# Altium project PCB_Project2.PrjPCB
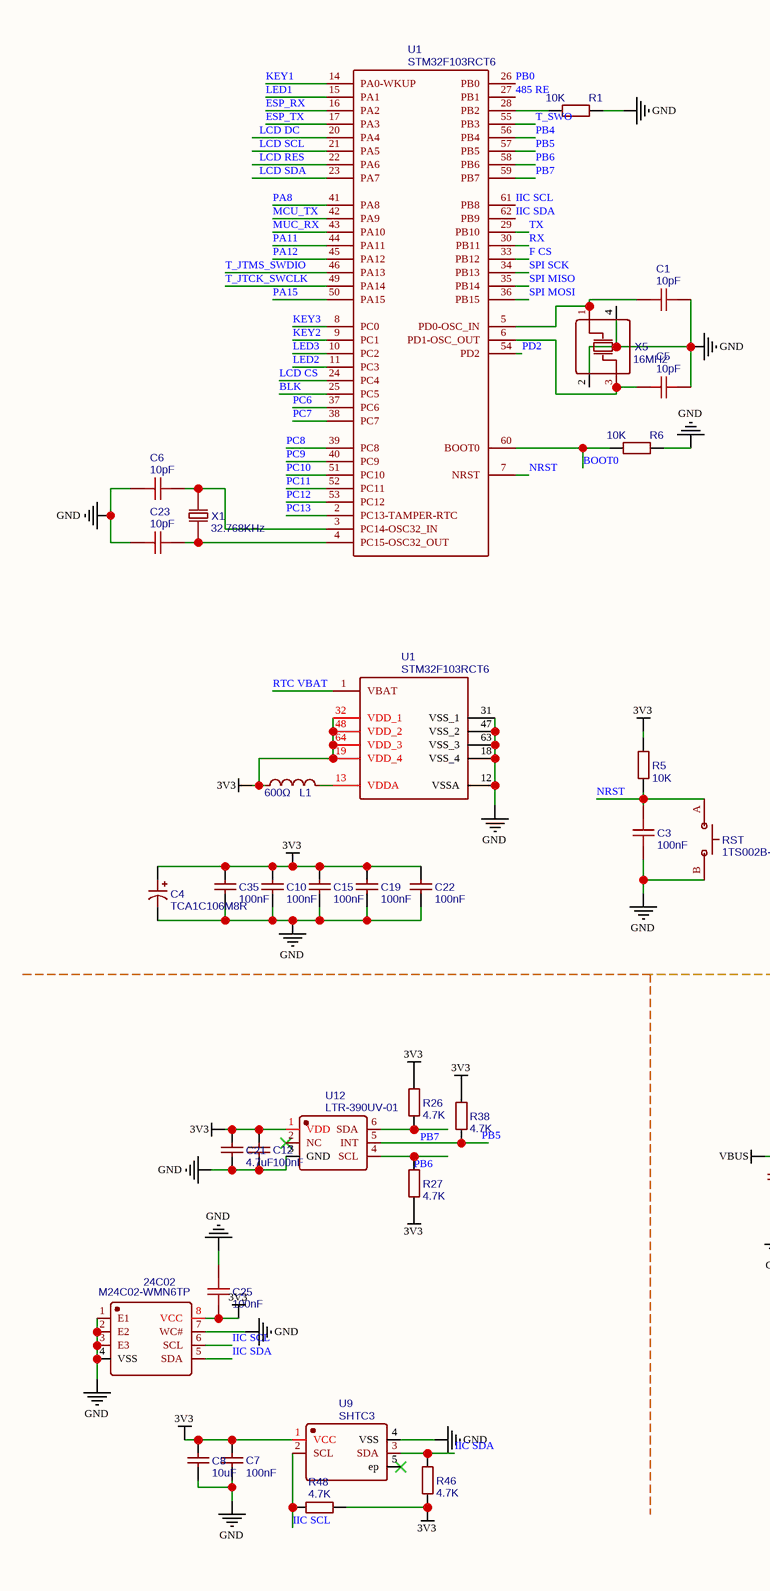
[diagram p0: Sheet_1_2022-02-19.schdoc, left]
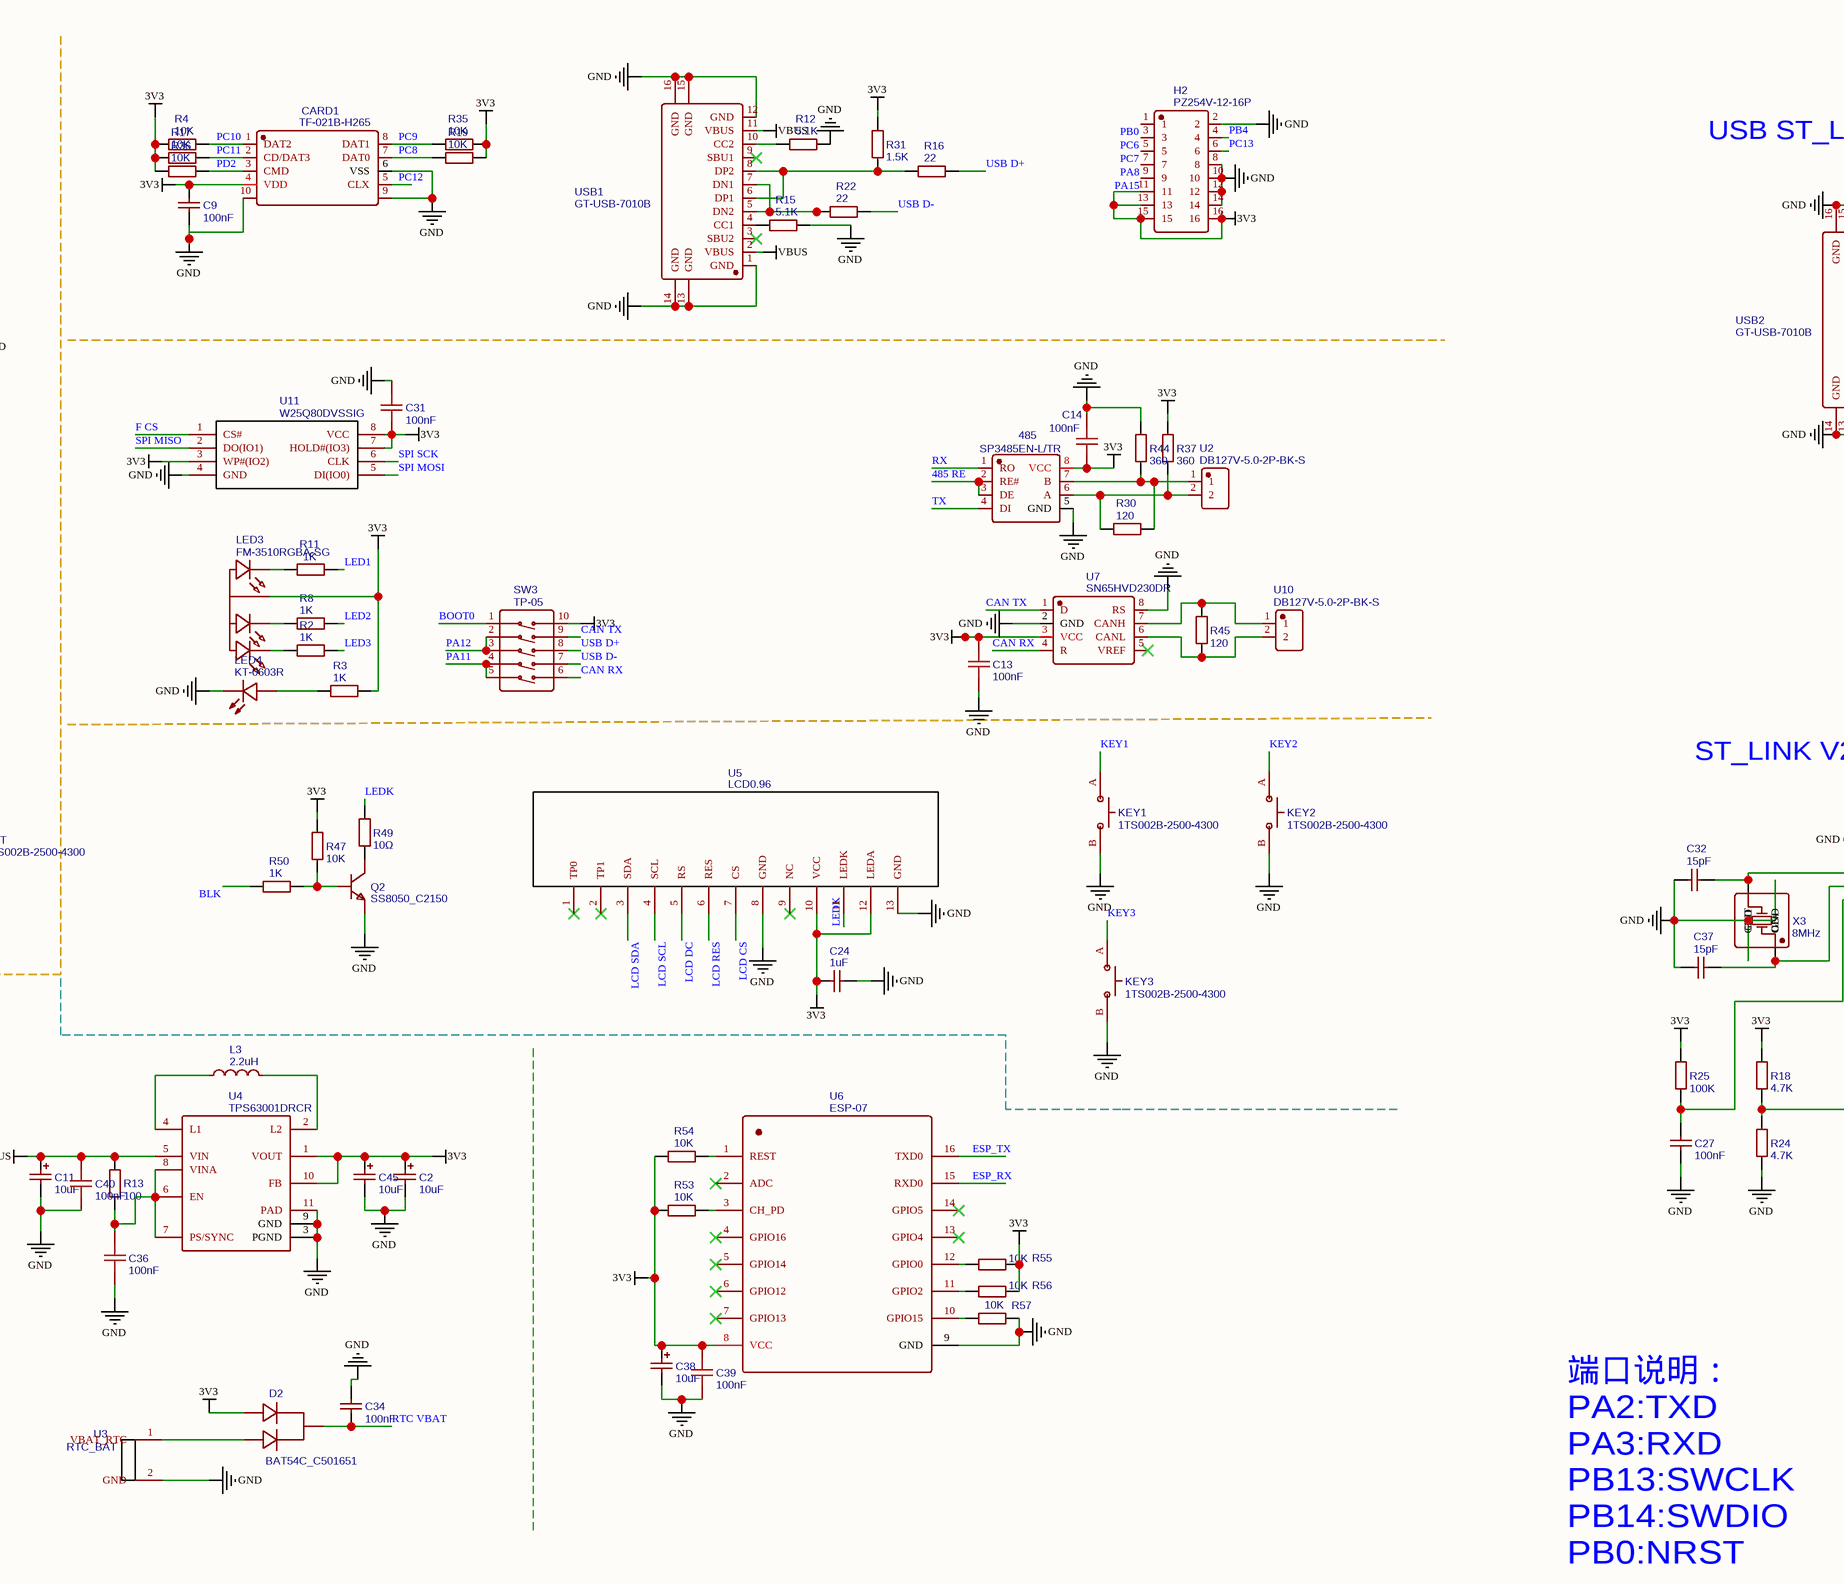
[diagram p1: Sheet_1_2022-02-19.schdoc, middle]
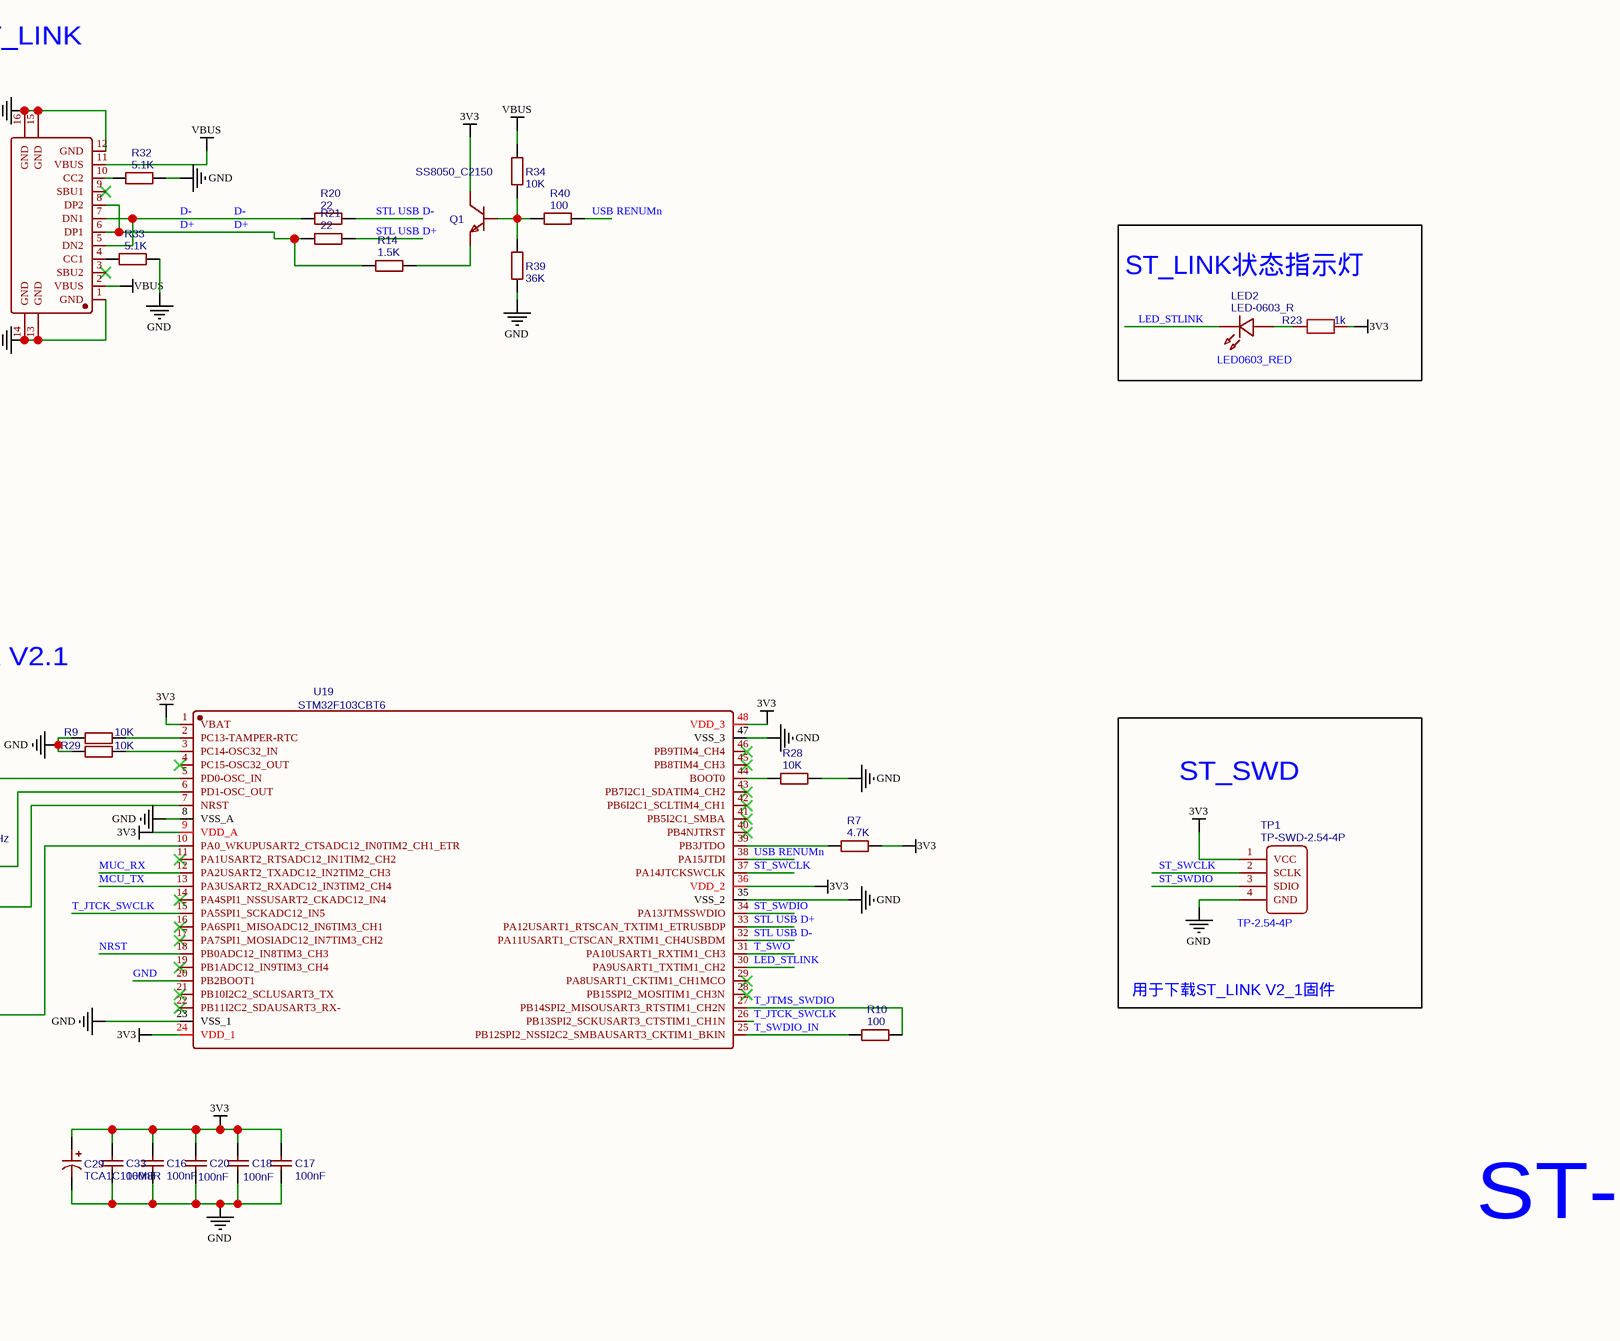
[diagram p2: Sheet_1_2022-02-19.schdoc, right]
1 sheet, 126 parts. Net scope: global (net labels, ports and power ports of the same name join across sheets).
Board file: F103RCT6验证板_2022-02-19.pcbdoc

## Sheet Sheet_1_2022-02-19.schdoc
size 832 x 302 mm

### Parts
(Parts that share a designator on the sheet are numbered #1, #2 ... from top to bottom, then left to right.)
24C02  M24C02-WMN6TP  [SOIC-8_L4.9-W3.9-P1.27-LS6.0-BL]
485  SP3485EN-L/TR  [SOIC-8_L5.0-W4.0-P1.27-LS6.0-BL]
C1  10pF  [C0402]
C2  10uF  [CAP-SMD_L3.2-W1.6-R-RD]
C3  100nF  [C0603]
C4  TCA1C106M8R  [CAP-SMD_L3.2-W1.6-FD]
C5  10pF  [C0402]
C6  10pF  [C0402]
C7  100nF  [C0402_NEW]
C8  10uF  [C0402]
C9  100nF  [C0402_NEW]
C10  100nF  [C0402_NEW]
C11  10uF  [CAP-SMD_L3.2-W1.6-R-RD]
C12  100nF  [C0402_NEW]
C13  100nF  [C0603]
C14  100nF  [C0603]
C15  100nF  [C0402_NEW]
C16  100nF  [C0402_NEW]
C17  100nF  [C0402_NEW]
C18  100nF  [C0402_NEW]
C19  100nF  [C0402_NEW]
C20  100nF  [C0402_NEW]
C21  4.7uF  [C0402]
C22  100nF  [C0402_NEW]
C23  10pF  [C0402]
C24  1uF  [C0603]
C25  100nF  [C0603]
C27  100nF  [C0402_NEW]
C29  TCA1C106M8R  [CAP-SMD_L3.2-W1.6-FD]
C31  100nF  [C0603]
C32  15pF  [C0402]
C33  100nF  [C0402_NEW]
C34  100nF  [C0402_NEW]
C35  100nF  [C0402_NEW]
C36  100nF  [C0603]
C37  15pF  [C0402]
C38  10uF  [CAP-SMD_L3.2-W1.6-R-RD]
C39  100nF  [C0603]
C40  100nF  [C0603]
C45  10uF  [CAP-SMD_L3.2-W1.6-R-RD]
CARD1  TF-021B-H265  [TF-SMD_TF-021B-H265]
D2  BAT54C_C501651  [SOT-23-3_L2.9-W1.3-P1.90-LS2.4-BR]
H2  PZ254V-12-16P  [HDR-TH_16P-P2.54-V-M-R2-C8-S2.54]
KEY1  1TS002B-2500-4300  [SW-SMD_L3.5-W6.0-P8.20]
KEY2  1TS002B-2500-4300  [SW-SMD_L3.5-W6.0-P8.20]
KEY3  1TS002B-2500-4300  [SW-SMD_L3.5-W6.0-P8.20]
L1  600Ω  [L0603]
L3  2.2uH  [IND-SMD_L2.5-W2.0_SPH252012]
LED2  LED-0603_R  [LED0603_RED]
LED3  FM-3510RGBA-SG  [LED-SMD_FM-3510RGBA-SG]
LED4  KT-0603R  [LED0603-R-RD]
Q1  SS8050_C2150  [SOT-23-3_L2.9-W1.3-P1.90-LS2.4-BR]
Q2  SS8050_C2150  [SOT-23-3_L2.9-W1.3-P1.90-LS2.4-BR]
R1  10K  [R0402]
R2  1K  [R0603]
R3  1K  [R0603]
R4  10K  [R0402]
R5  10K  [R0603]
R6  10K  [R0402]
R7  4.7K  [R0402]
R8  1K  [R0603]
R9  10K  [R0402]
R10  100  [R0402]
R11  1K  [R0603]
R12  5.1K  [R0603]
R13  100  [R0603]
R14  1.5K  [R0603]
R15  5.1K  [R0603]
R16  22  [R0603]
R17  10K  [R0402]
R18  4.7K  [R0402]
R19  10K  [R0402]
R20  22  [R0603]
R21  22  [R0603]
R22  22  [R0603]
R23  1k  [0603]
R24  4.7K  [R0402]
R25  100K  [R0402]
R26  4.7K  [R0603]
R27  4.7K  [R0603]
R28  10K  [R0402]
R29  10K  [R0402]
R30  120  [R0603]
R31  1.5K  [R0603]
R32  5.1K  [R0603]
R33  5.1K  [R0603]
R34  10K  [R0603]
R35  10K  [R0402]
R36  10K  [R0402]
R37  360  [R0603]
R38  4.7K  [R0603]
R39  36K  [R0603]
R40  100  [R0603]
R44  360  [R0603]
R45  120  [R0603]
R46  4.7K  [R0603]
R47  10K  [R0603]
R48  4.7K  [R0603]
R49  10Ω  [R0603]
R50  1K  [R0603]
R53  10K  [R0603]
R54  10K  [R0603]
R55  10K  [R0603]
R56  10K  [R0603]
R57  10K  [R0603]
RST  1TS002B-2500-4300  [SW-SMD_L3.5-W6.0-P8.20]
SW3  TP-05  [SW-SMD_TP-05]
TP1  TP-SWD-2.54-4P  [TP-2.54-4P]
U1#1  STM32F103RCT6  [LQFP-64_L10.0-W10.0-P0.50-LS12.0-BL]
U1#2  STM32F103RCT6  [LQFP-64_L10.0-W10.0-P0.50-LS12.0-BL]
U2  DB127V-5.0-2P-BK-S  [CONN-TH_2P-P5.00_DB127V-5.0-2P-BK-S]
U3  RTC_BAT  [RTC_BAT]
U4  TPS63001DRCR  [VSON-10_L3.0-W3.0-P0.50-TL-EP_TPS62410DRCR]
U5  LCD0.96  [LCD0.96]
U6  ESP-07  [WIFIM-SMD_ESP-07]
U7  SN65HVD230DR  [SOIC-8_L4.9-W3.9-P1.27-LS6.0-BL]
U9  SHTC3  [SENSORM-SMD_4P-L2.0-W2.0-P1.00]
U10  DB127V-5.0-2P-BK-S  [CONN-TH_2P-P5.00_DB127V-5.0-2P-BK-S]
U11  W25Q80DVSSIG  [SOIC-8_L5.3-W5.3-P1.27-LS8.0-BL]
U12  LTR-390UV-01  [SENSOR-SMD_LTR-390UV-01]
U19  STM32F103CBT6  [LQFP-48_L7.0-W7.0-P0.50-LS9.0-BL]
USB1  GT-USB-7010B  [USB-C-SMD_GT-USB-7010B]
USB2  GT-USB-7010B  [USB-C-SMD_GT-USB-7010B]
X1  32.768KHz  [FC-135R_L3.2-W1.5]
X3  8MHz  [OSC-SMD_4P-L3.2-W2.5-BL]
X5  16MHz  [OSC-SMD_4P-L3.2-W2.5-BL]

### Blocks framed on the sheet
ST_LINK状态指示灯: LED2 R23
ST_SWD: TP1

### Nets
3V3: 24C02.8(VCC) 485.8(VCC) C2.1 C4.1 C7.2 C8.2 C9.2 C10.2 C12.2 C13.2 C14.1 C15.2 C16.2 C17.2 C18.2 C19.2 C20.2 C21.2 C22.2 C24.1 C25.1 C29.1 C31.2 C33.2 C35.2 C38.1 C39.2 C45.1 CARD1.4(VDD) D2.1(A1) H2.11 H2.13 H2.15 H2.16 L1.1 LED3.2(+) Q1.3(C) R3.2 R4.2 R5.1 R7.1 R17.2 R18.1 R19.1 R23.1 R25.2 R26.2 R27.1 R31.2 R35.1 R36.2 R37.2 R38.2 R46.1 R47.2 R48.1 R53.1 R54.1 R55.2 R56.2 SW3.10 TP1.1(VCC) U1#2.19(VDD_4) U1#2.32(VDD_1) U1#2.48(VDD_2) U1#2.64(VDD_3) U4.1(VOUT) U4.10(FB) U5.10(VCC) U5.12(LEDA) U6.8(VCC) U7.3(VCC) U9.1(VCC) U11.3(WP#(IO2)) U11.7(HOLD#(IO3)) U11.8(VCC) U12.1(VDD) U19.1(VBAT) U19.9(VDD_A) U19.24(VDD_1) U19.36(VDD_2) U19.48(VDD_3)
GND: 24C02.1(E1) 24C02.2(E2) 24C02.3(E3) 24C02.4(VSS) 24C02.7(WC#) 485.5(GND) C1.1 C2.2 C3.1 C4.2 C5.1 C6.2 C7.1 C8.1 C9.1 C10.1 C11.2 C12.1 C13.1 C14.2 C15.1 C16.1 C17.1 C18.1 C19.1 C20.1 C21.1 C22.1 C23.2 C24.2 C25.2 C27.1 C29.2 C31.1 C32.1 C33.1 C34.2 C35.1 C36.1 C37.1 C38.2 C39.1 C40.1 C45.2 CARD1.6(VSS) CARD1.9 CARD1.10 H2.2 H2.8 H2.10 H2.12 H2.14 KEY1.B KEY2.B KEY3.B LED4.2(K) Q2.2(E) R1.2 R6.2 R9.2 R12.2 R15.2 R24.2 R28.1 R29.2 R32.2 R33.2 R39.1 R44.2 R57.2 RST.B TP1.4(GND) U1#2.12(VSSA) U1#2.18(VSS_4) U1#2.31(VSS_1) U1#2.47(VSS_2) U1#2.63(VSS_3) U3.2(GND) U4.3(PGND) U4.9(GND) U4.11(PAD) U5.8(GND) U5.13(GND) U6.9(GND) U7.2(GND) U7.8(RS) U9.4(VSS) U11.4(GND) U12.3(GND) U19.8(VSS_A) U19.20(PB2BOOT1) U19.23(VSS_1) U19.35(VSS_2) U19.47(VSS_3) USB1.1(GND) USB1.12(GND) USB1.13(GND) USB1.14(GND) USB1.15(GND) USB1.16(GND) USB2.1(GND) USB2.12(GND) USB2.13(GND) USB2.14(GND) USB2.15(GND) USB2.16(GND) X3.2(GND) X3.4(GND) X5.2(GND) X5.4(GND)
VBUS: C11.1 C40.2 R13.2 R34.2 U4.5(VIN) USB1.2(VBUS) USB1.11(VBUS) USB2.2(VBUS) USB2.11(VBUS)
485 RE: 485.2(RE#) 485.3(DE) U1#1.27(PB1)
BLK: R50.1 U1#1.25(PC5)
BOOT0: R6.1 SW3.1 U1#1.60(BOOT0)
CAN RX: SW3.6 U7.4(R)
CAN TX: SW3.9 U7.1(D)
D+: R14.2 R21.1 USB2.6(DP1) USB2.8(DP2)
D-: R20.1 USB2.5(DN2) USB2.7(DN1)
ESP_RX: U1#1.16(PA2) U6.15(RXD0)
ESP_TX: U1#1.17(PA3) U6.16(TXD0)
F CS: U1#1.33(PB12) U11.1(CS#)
IIC SCL: 24C02.6(SCL) R48.2 U1#1.61(PB8) U9.2(SCL)
IIC SDA: 24C02.5(SDA) R46.2 U1#1.62(PB9) U9.3(SDA)
KEY1: KEY1.A U1#1.14(PA0-WKUP)
KEY2: KEY2.A U1#1.9(PC1)
KEY3: KEY3.A U1#1.8(PC0)
LCD CS: U1#1.24(PC4) U5.7(CS)
LCD DC: U1#1.20(PA4) U5.5(RS)
LCD RES: U1#1.22(PA6) U5.6(RES)
LCD SCL: U1#1.21(PA5) U5.4(SCL)
LCD SDA: U1#1.23(PA7) U5.3(SDA)
LED1: R11.2 U1#1.15(PA1)
LED2: R8.2 U1#1.11(PC3)
LED3: R2.2 U1#1.10(PC2)
LED_STLINK: LED2.2 U19.30(PA9USART1_TXTIM1_CH2)
LEDK: R49.2 U5.11(LEDK)
MCU_TX: U1#1.42(PA9) U19.13(PA3USART2_RXADC12_IN3TIM2_CH4)
MUC_RX: U1#1.43(PA10) U19.12(PA2USART2_TXADC12_IN2TIM2_CH3)
NRST: C3.2 R5.2 RST.A U1#1.7(NRST) U19.18(PB0ADC12_IN8TIM3_CH3)
PA8: H2.7 U1#1.41(PA8)
PA11: SW3.4 SW3.5 U1#1.44(PA11)
PA12: SW3.2 SW3.3 U1#1.45(PA12)
PA15: H2.9 U1#1.50(PA15)
PB0: H2.1 U1#1.26(PB0)
PB4: H2.4 U1#1.56(PB4)
PB5: R38.1 U1#1.57(PB5) U12.5(INT)
PB6: R27.2 U1#1.58(PB6) U12.4(SCL)
PB7: R26.1 U1#1.59(PB7) U12.6(SDA)
PC6: H2.3 U1#1.37(PC6)
PC7: H2.5 U1#1.38(PC7)
PC8: CARD1.7(DAT0) R19.2 U1#1.39(PC8)
PC9: CARD1.8(DAT1) R35.2 U1#1.40(PC9)
PC10: CARD1.1(DAT2) R4.1 U1#1.51(PC10)
PC11: CARD1.2(CD/DAT3) R17.1 U1#1.52(PC11)
PC12: CARD1.5(CLX) U1#1.53(PC12)
PC13: H2.6 U1#1.2(PC13-TAMPER-RTC)
PD2: CARD1.3(CMD) R36.1 U1#1.54(PD2)
RTC VBAT: C34.1 D2.3(K) U1#2.1(VBAT)
RX: 485.1(RO) U1#1.30(PB11)
SPI MISO: U1#1.35(PB14) U11.2(DO(IO1))
SPI MOSI: U1#1.36(PB15) U11.5(DI(IO0))
SPI SCK: U1#1.34(PB13) U11.6(CLK)
ST_SWCLK: TP1.2(SCLK) U19.37(PA14JTCKSWCLK)
ST_SWDIO: TP1.3(SDIO) U19.34(PA13JTMSSWDIO)
STL USB D+: R21.2 U19.33(PA12USART1_RTSCAN_TXTIM1_ETRUSBDP)
STL USB D-: R20.2 U19.32(PA11USART1_CTSCAN_RXTIM1_CH4USBDM)
T_JTCK_SWCLK: U1#1.49(PA14) U19.15(PA5SPI1_SCKADC12_IN5) U19.26(PB13SPI2_SCKUSART3_CTSTIM1_CH1N)
T_JTMS_SWDIO: R10.2 U1#1.46(PA13) U19.27(PB14SPI2_MISOUSART3_RTSTIM1_CH2N)
T_SWDIO_IN: R10.1 U19.25(PB12SPI2_NSSI2C2_SMBAUSART3_CKTIM1_BKIN)
T_SWO: U1#1.55(PB3) U19.31(PA10USART1_RXTIM1_CH3)
TX: 485.4(DI) U1#1.29(PB10)
USB D+: R16.2 SW3.8
USB D-: R22.2 SW3.7
USB RENUMn: R40.2 U19.38(PA15JTDI)
Net485_6: 485.6(A) R30.2 R37.1 U2.2
Net485_7: 485.7(B) R30.1 R44.1 U2.1
NetC1_2: C1.2 U1#1.5(PD0-OSC_IN) X5.1(OSC1)
NetC5_2: C5.2 U1#1.6(PD1-OSC_OUT) X5.3(OSC2)
NetC6_1: C6.1 U1#1.3(PC14-OSC32_IN) X1.2
NetC23_1: C23.1 U1#1.4(PC15-OSC32_OUT) X1.1
NetC27_2: C27.2 R25.1 U19.7(NRST)
NetC32_2: C32.2 U19.5(PD0-OSC_IN) X3.3(OUT)
NetC36_2: C36.2 R13.1 U4.6(EN) U4.7(PS/SYNC) U4.8(VINA)
NetC37_2: C37.2 U19.6(PD1-OSC_OUT) X3.1(OE#)
NetD2_2: D2.2(A2) U3.1(VBAT_RTC)
NetL1_2: L1.2 U1#2.13(VDDA)
NetL3_1: L3.1 U4.4(L1)
NetL3_2: L3.2 U4.2(L2)
NetLED2_1: LED2.1 R23.2
NetLED3_1: LED3.1(-) R11.1
NetLED3_3: LED3.3(-) R8.1
NetLED3_4: LED3.4(-) R2.1
NetLED4_1: LED4.1(A) R3.1
NetQ1_1: Q1.1(B) R34.1 R39.2 R40.1
NetQ1_2: Q1.2(E) R14.1
NetQ2_1: Q2.1(B) R47.1 R50.2
NetQ2_3: Q2.3(C) R49.1
NetR1_1: R1.1 U1#1.28(PB2)
NetR7_2: R7.2 U19.39(PB3JTDO)
NetR9_1: R9.1 U19.2(PC13-TAMPER-RTC)
NetR12_1: R12.1 USB1.10(CC2)
NetR15_1: R15.1 USB1.4(CC1)
NetR16_1: R16.1 R31.1 USB1.6(DP1) USB1.8(DP2)
NetR18_2: R18.2 R24.1 U19.10(PA0_WKUPUSART2_CTSADC12_IN0TIM2_CH1_ETR)
NetR22_1: R22.1 USB1.5(DN2) USB1.7(DN1)
NetR28_2: R28.2 U19.44(BOOT0)
NetR29_1: R29.1 U19.3(PC14-OSC32_IN)
NetR32_1: R32.1 USB2.10(CC2)
NetR33_1: R33.1 USB2.4(CC1)
NetR45_1: R45.1 U7.6(CANL) U10.2
NetR45_2: R45.2 U7.7(CANH) U10.1
NetR53_2: R53.2 U6.3(CH_PD)
NetR54_2: R54.2 U6.1(REST)
NetR55_1: R55.1 U6.12(GPIO0)
NetR56_1: R56.1 U6.11(GPIO2)
NetR57_1: R57.1 U6.10(GPIO15)

Not connected (* = marked no-connect by the designer): U5 1(TP0)* 2(TP1)* 9(NC)*; U6 2(ADC)* 4(GPIO16)* 5(GPIO14)* 6(GPIO12)* 7(GPIO13)* 13(GPIO4)* 14(GPIO5)*; U7 5(VREF)*; U9 5(ep)*; U12 2(NC)*; U19 4(PC15-OSC32_OUT)* 11(PA1USART2_RTSADC12_IN1TIM2_CH2)* 14(PA4SPI1_NSSUSART2_CKADC12_IN4)* 16(PA6SPI1_MISOADC12_IN6TIM3_CH1)* 17(PA7SPI1_MOSIADC12_IN7TIM3_CH2)* 19(PB1ADC12_IN9TIM3_CH4)* 21(PB10I2C2_SCLUSART3_TX)* 22(PB11I2C2_SDAUSART3_RX-)* 28(PB15SPI2_MOSITIM1_CH3N)* 29(PA8USART1_CKTIM1_CH1MCO)* 40(PB4NJTRST)* 41(PB5I2C1_SMBA)* 42(PB6I2C1_SCLTIM4_CH1)* 43(PB7I2C1_SDATIM4_CH2)* 45(PB8TIM4_CH3)* 46(PB9TIM4_CH4)*; USB1 3(SBU2)* 9(SBU1)*; USB2 3(SBU2)* 9(SBU1)*

### Notes on the sheet
- USB ST_LINK
- ST_LINK V2.1
- 用于下载ST_LINK V2_1固件
- 端口说明：
  PA2:TXD
  PA3:RXD
  PB13:SWCLK
  PB14:SWDIO
  PB0:NRST
- ST-LINK
- (in symbol LED-0603_R) LED0603_RED
- (in symbol TP-SWD-2.54-4P) TP-2.54-4P

### Library data of the parts
24C02 = M24C02-WMN6TP: BOM_Manufacturer: STMicroelectronics; spicePre: X; BOM_Supplier: LCSC; BOM_Manufacturer Part: M24C02-WMN6TP; BOM_Supplier Part: C7562; BOM_JLCPCB Part Class: Basic Part; spiceSymbolName: M24C02-WMN6TP
485 = SP3485EN-L/TR: BOM_Manufacturer: EXAR; BOM_Supplier: LCSC; BOM_Manufacturer Part: SP3485EN-L/TR; BOM_Supplier Part: C8963; BOM_JLCPCB Part Class: Basic Part; spicePre: U; spiceSymbolName: SP3485EN-L/TR
C1 C5 C6 C23 = 10pF: BOM_Manufacturer: SAMSUNG; BOM_Manufacturer Part: CL05C100JB5NNNC; nameAlias: Capacitance; BOM_Supplier: LCSC; BOM_Supplier Part: C32949; BOM_JLCPCB Part Class: Basic Part; spicePre: C; spiceSymbolName: CL05C100JB5NNNC
C2 C45 = 10uF: BOM_Manufacturer: Sunlord; BOM_Manufacturer Part: TC211A106M016Y; nameAlias: Capacitance; BOM_Supplier: LCSC; BOM_Supplier Part: C128289; BOM_JLCPCB Part Class: Extended Part; spicePre: C; spiceSymbolName: TC211A106M016Y
C3 C13 C14 C25 C31 C36 C39 C40 = 100nF: BOM_Manufacturer: YAGEO; BOM_Manufacturer Part: CC0603KRX7R9BB104; nameAlias: Capacitance; BOM_Paste Type: base; BOM_Supplier: LCSC; BOM_Supplier Part: C14663; spicePre: C; spiceSymbolName: CC0603KRX7R9BB104
  C3 C31 C36 C40: BOM_JLCPCB Part Class: Basic Part
C4 C29 = TCA1C106M8R: BOM_Manufacturer: ROHM(罗姆); Contributor: LCSC; BOM_Supplier: LCSC; BOM_Supplier Part: C880927; BOM_Manufacturer Part: TCA1C106M8R; BOM_JLCPCB Part Class: Extended Part; spicePre: C; spiceSymbolName: TCA1C106M8R
C7 C9 C10 C12 C15-C20 C22 C27 C33-C35 = 100nF: BOM_Manufacturer Part: CL05B104KO5NNNC; BOM_Manufacturer: SAMSUNG; nameAlias: Capacitance; BOM_Supplier: LCSC; BOM_Supplier Part: C1525; BOM_JLCPCB Part Class: Basic Part; spicePre: C; spiceSymbolName: CL05B104KO5NNNC
C8 = 10uF: BOM_Manufacturer Part: CL05A106MQ5NUNC; BOM_Manufacturer: SAMSUNG; nameAlias: Capacitance; BOM_Supplier: LCSC; BOM_Supplier Part: C15525; BOM_JLCPCB Part Class: Basic Part; spicePre: C; spiceSymbolName: CL05A106MQ5NUNC
C11 C38 = 10uF: BOM_Manufacturer: Sunlord; BOM_Manufacturer Part: TC212A106K016B; nameAlias: Capacitance; BOM_Supplier: LCSC; BOM_Supplier Part: C124854; BOM_JLCPCB Part Class: Extended Part; spicePre: C; spiceSymbolName: TC212A106K016B
C21 = 4.7uF: BOM_Manufacturer Part: CL05A475MP5NRNC; BOM_Manufacturer: SAMSUNG; nameAlias: Capacitance; BOM_Supplier: LCSC; BOM_Supplier Part: C23733; BOM_JLCPCB Part Class: Basic Part; spicePre: C; spiceSymbolName: CL05A475MP5NRNC
C24 = 1uF: BOM_Manufacturer Part: CL10A105KB8NNNC; BOM_Manufacturer: SAMSUNG; nameAlias: Capacitance; BOM_Supplier: LCSC; BOM_Supplier Part: C15849; BOM_JLCPCB Part Class: Basic Part; spicePre: C; spiceSymbolName: CL10A105KB8NNNC
C32 C37 = 15pF: BOM_Manufacturer: FH; BOM_Manufacturer Part: 0402CG150J500NT; nameAlias: Capacitance; BOM_Supplier: LCSC; BOM_Supplier Part: C1548; BOM_JLCPCB Part Class: Basic Part; spicePre: C; spiceSymbolName: 0402CG150J500NT
CARD1 = TF-021B-H265: BOM_Manufacturer: SOFNG; Contributor: LCSC; BOM_Supplier: LCSC; BOM_Supplier Part: C498185; BOM_Manufacturer Part: TF-021B-H265; BOM_JLCPCB Part Class: Extended Part; spicePre: C; spiceSymbolName: TF-021B-H265
D2 = BAT54C_C501651: BOM_Manufacturer: JF; BOM_Manufacturer Part: BAT54C; Contributor: LCSC; BOM_Supplier: LCSC; BOM_Supplier Part: C501651; spicePre: D; spiceSymbolName: BAT54C_C501651
H2 = PZ254V-12-16P: BOM_Manufacturer: XFCN; Contributor: LCSC; BOM_Supplier: LCSC; BOM_Supplier Part: C492425; BOM_Manufacturer Part: PZ254V-12-16P; BOM_JLCPCB Part Class: Extended Part; spicePre: H; spiceSymbolName: PZ254V-12-16P
KEY1-KEY3 RST = 1TS002B-2500-4300: BOM_Manufacturer: HYP; Contributor: LCSC; BOM_Supplier: LCSC; BOM_Supplier Part: C255788; BOM_Manufacturer Part: 1TS002B-2500-4300; BOM_JLCPCB Part Class: Extended Part; spicePre: S; spiceSymbolName: 1TS002B-2500-4300
L1 = 600Ω: BOM_Manufacturer: FH; BOM_Manufacturer Part: CBW160808U601T; nameAlias: Value; Contributor: LCSC; BOM_Supplier: LCSC; BOM_Supplier Part: C139183; spicePre: L; spiceSymbolName: CBW160808U601T
L3 = 2.2uH: BOM_Manufacturer: Sunlord; BOM_Manufacturer Part: SPH252012H2R2MT; nameAlias: Inductance; Contributor: LCSC; BOM_Supplier: LCSC; BOM_Supplier Part: C142487; BOM_JLCPCB Part Class: Extended Part; spicePre: L; spiceSymbolName: SPH252012H2R2MT
LED2 = LED-0603_R: BOM_Manufacturer: EVERLIGHT(台湾亿光); BOM_Manufacturer Part: 19-217/R6C-AL1M2VY/3T; Contributor: LCEDA_01; Package Display: Yes; BOM_Supplier Part: C72044; BOM_Supplier: LCSC; spicePre: L; spiceSymbolName: LED-0603_R
LED3 = FM-3510RGBA-SG: BOM_Manufacturer: Foshan NationStar Optoelectronics; Contributor: LCSC; BOM_Supplier: LCSC; BOM_Supplier Part: C727903; BOM_Manufacturer Part: FM-3510RGBA-SG; BOM_JLCPCB Part Class: Extended Part; spicePre: L; spiceSymbolName: FM-3510RGBA-SG
LED4 = KT-0603R: BOM_Manufacturer: KENTO; BOM_Supplier: LCSC; BOM_Manufacturer Part: KT-0603R; BOM_Supplier Part: C2286; BOM_JLCPCB Part Class: Basic Part; spicePre: L; spiceSymbolName: KT-0603R
Q1 Q2 = SS8050_C2150: BOM_Manufacturer: CJ; BOM_Manufacturer Part: SS8050; BOM_Supplier: LCSC; BOM_Supplier Part: C2150; BOM_JLCPCB Part Class: Basic Part; spicePre: Q; spiceSymbolName: SS8050_C2150
R1 R4 R6 R9 R17 R19 R28 R29 R35 R36 = 10K: BOM_Manufacturer: UniOhm; BOM_Manufacturer Part: 0402WGF1002TCE; nameAlias: Resistance (Ohms); BOM_Supplier: LCSC; BOM_Supplier Part: C25744; BOM_JLCPCB Part Class: Basic Part; spicePre: R; spiceSymbolName: 0402WGF1002TCE
R2 R3 R8 R11 = 1K: BOM_Manufacturer: UniOhm; BOM_Manufacturer Part: 0603WAF1001T5E; nameAlias: Resistance (Ohms); BOM_Paste Type: base; BOM_Supplier: LCSC; BOM_Supplier Part: C21190; spicePre: R; spiceSymbolName: 0603WAF1001T5E
R5 R34 = 10K: BOM_Manufacturer: Viking Tech; BOM_Manufacturer Part: AR03DTCX1002; nameAlias: Resistance (Ohms); Contributor: LCSC; BOM_Supplier: LCSC; BOM_Supplier Part: C319937; spicePre: R; spiceSymbolName: AR03DTCX1002
R7 R18 R24 = 4.7K: BOM_Manufacturer: UniOhm; BOM_Manufacturer Part: 0402WGF4701TCE; nameAlias: Resistance (Ohms); BOM_Supplier: LCSC; BOM_Supplier Part: C25900; BOM_JLCPCB Part Class: Basic Part; spicePre: R; spiceSymbolName: 0402WGF4701TCE
R10 = 100: BOM_Manufacturer: UniOhm; BOM_Manufacturer Part: 0402WGF1000TCE; nameAlias: Resistance (Ohms); BOM_Supplier: LCSC; BOM_Supplier Part: C25076; BOM_JLCPCB Part Class: Basic Part; spicePre: R; spiceSymbolName: 0402WGF1000TCE
R12 R15 R32 R33 = 5.1K: BOM_Manufacturer Part: 0603WAF5101T5E; BOM_Manufacturer: UniOhm; nameAlias: Resistance (Ohms); BOM_Supplier: LCSC; BOM_Supplier Part: C23186; BOM_JLCPCB Part Class: Basic Part; spicePre: R; spiceSymbolName: 0603WAF5101T5E
R13 R40 = 100: BOM_Manufacturer: UniOhm; BOM_Manufacturer Part: 0603WAF1000T5E; nameAlias: Resistance (Ohms); BOM_Supplier: LCSC; BOM_Supplier Part: C22775; BOM_JLCPCB Part Class: Basic Part; spicePre: R; spiceSymbolName: 0603WAF1000T5E
R14 R31 = 1.5K: BOM_Manufacturer: UniOhm; BOM_Manufacturer Part: 0603WAF1501T5E; nameAlias: Resistance (Ohms); BOM_Supplier: LCSC; BOM_Supplier Part: C22843; BOM_JLCPCB Part Class: Basic Part; spicePre: R; spiceSymbolName: 0603WAF1501T5E
R16 R20-R22 = 22: BOM_Manufacturer: UniOhm; BOM_Manufacturer Part: 0603WAF220JT5E; nameAlias: Resistance (Ohms); BOM_Supplier: LCSC; BOM_Supplier Part: C23345; BOM_JLCPCB Part Class: Basic Part; spicePre: R; spiceSymbolName: 0603WAF220JT5E
R23 = 1k: BOM_Manufacturer: YAGEO; nameAlias: Value(Ω); spicePre: R; spiceSymbolName: Res_0603(1/10W)_EU; BOM_Supplier: LCSC; BOM_Supplier Part: C22548
R25 = 100K: BOM_Manufacturer: UniOhm; BOM_Manufacturer Part: 0402WGF1003TCE; nameAlias: Resistance (Ohms); BOM_Supplier: LCSC; BOM_Supplier Part: C25741; BOM_JLCPCB Part Class: Basic Part; spicePre: R; spiceSymbolName: 0402WGF1003TCE
R26 R27 R38 R46 R48 = 4.7K: BOM_Manufacturer: UniOhm; BOM_Manufacturer Part: 0603WAJ0472T5E; nameAlias: Resistance (Ohms); BOM_Paste Type: expand; BOM_Assembly Type: smtWeld; BOM_Supplier: LCSC; BOM_Supplier Part: C25999; spicePre: R; spiceSymbolName: 0603WAJ0472T5E
R30 R45 = 120: BOM_Manufacturer: UniOhm; BOM_Manufacturer Part: 0603WAF1200T5E; nameAlias: Resistance (Ohms); BOM_Supplier: LCSC; BOM_Supplier Part: C22787; BOM_JLCPCB Part Class: Basic Part; spicePre: R; spiceSymbolName: 0603WAF1200T5E
R37 R44 = 360: BOM_Manufacturer: UniOhm; BOM_Manufacturer Part: 0603WAF3600T5E; nameAlias: Resistance (Ohms); BOM_Supplier: LCSC; BOM_Supplier Part: C25194; BOM_JLCPCB Part Class: Basic Part; spicePre: R; spiceSymbolName: 0603WAF3600T5E
R39 = 36K: BOM_Manufacturer: UniOhm; BOM_Manufacturer Part: 0603WAF3602T5E; nameAlias: Resistance (Ohms); BOM_Supplier: LCSC; BOM_Supplier Part: C23147; BOM_JLCPCB Part Class: Basic Part; spicePre: R; spiceSymbolName: 0603WAF3602T5E
R47 R53-R57 = 10K: BOM_Manufacturer: UniOhm; BOM_Manufacturer Part: 0603WAF1002T5E; nameAlias: Resistance (Ohms); BOM_Paste Type: base; BOM_Supplier: LCSC; BOM_Supplier Part: C25804; spicePre: R; spiceSymbolName: 0603WAF1002T5E
R49 = 10Ω: BOM_Manufacturer: UniOhm; BOM_Manufacturer Part: 0603WAF100JT5E; nameAlias: Resistance (Ohms); BOM_Supplier: LCSC; BOM_Supplier Part: C22859; BOM_JLCPCB Part Class: Basic Part; spicePre: R; spiceSymbolName: 0603WAF100JT5E
R50 = 1K: BOM_Manufacturer: UniOhm; BOM_Manufacturer Part: 0603WAF1001T5E; nameAlias: Resistance (Ohms); BOM_Supplier: LCSC; BOM_Supplier Part: C21190; BOM_JLCPCB Part Class: Basic Part; spicePre: R; spiceSymbolName: 0603WAF1001T5E
SW3 = TP-05: BOM_Manufacturer: Yuandi; Contributor: LCSC; BOM_Supplier: LCSC; BOM_Supplier Part: C559168; BOM_Manufacturer Part: TP-05; BOM_JLCPCB Part Class: Extended Part; spicePre: S; spiceSymbolName: TP-05
TP1 = TP-SWD-2.54-4P: Contributor: CYIIOT; Package Display: Yes; spicePre: T; spiceSymbolName: TP-SWD-2.54-4P
U1#1 = STM32F103RCT6: BOM_Manufacturer: STMicroelectronics; subpart_no: 1; SMT Type: Basic; BOM_Supplier: LCSC; BOM_Manufacturer Part: STM32F103RCT6; BOM_LCSC Assembly: Yes; image: //image.lceda.cn/szlcsc/C8323.jpg; BOM_Supplier Part: C8323; BOM_JLCPCB Part Class: Extended Part; spicePre: U; spiceSymbolName: STM32F103RCT6
U1#2 = STM32F103RCT6: BOM_Manufacturer: STMicroelectronics; subpart_no: 2; SMT Type: Basic; BOM_Supplier: LCSC; BOM_Manufacturer Part: STM32F103RCT6; BOM_LCSC Assembly: Yes; image: //image.lceda.cn/szlcsc/C8323.jpg; BOM_Supplier Part: C8323; BOM_JLCPCB Part Class: Extended Part; spicePre: U; spiceSymbolName: STM32F103RCT6
U2 U10 = DB127V-5.0-2P-BK-S: BOM_Manufacturer: DIBO; Contributor: LCSC; BOM_Supplier: LCSC; BOM_Supplier Part: C430623; BOM_Manufacturer Part: DB127V-5.0-2P-BK-S; BOM_JLCPCB Part Class: Extended Part; spicePre: U; spiceSymbolName: DB127V-5.0-2P-BK-S
U3 = RTC_BAT: Contributor: WTDW; Package Display: No; spicePre: U; spiceSymbolName: RTC_BAT
U4 = TPS63001DRCR: BOM_Manufacturer: TI; BOM_Supplier: LCSC; BOM_Manufacturer Part: TPS63001DRCR; BOM_Supplier Part: C28060; BOM_JLCPCB Part Class: Extended Part; spicePre: U; spiceSymbolName: TPS63001DRCR
U5 = LCD0.96: Contributor: WTDW; spicePre: U; spiceSymbolName: LCD0.96
U6 = ESP-07: BOM_Manufacturer: Ai-Thinker; BOM_Supplier: LCSC; BOM_Manufacturer Part: ESP-07; BOM_Supplier Part: C82894; BOM_JLCPCB Part Class: Extended Part; spicePre: U; spiceSymbolName: ESP-07
U7 = SN65HVD230DR: BOM_Manufacturer: TI; BOM_Supplier: LCSC; BOM_Manufacturer Part: SN65HVD230DR; BOM_Supplier Part: C12084; BOM_JLCPCB Part Class: Basic Part; spicePre: U; spiceSymbolName: SN65HVD230DR
U9 = SHTC3: BOM_Manufacturer: Sensirion; Contributor: LCSC; BOM_Supplier: LCSC; BOM_Supplier Part: C194656; BOM_Manufacturer Part: SHTC3; BOM_JLCPCB Part Class: Extended Part; spicePre: U; spiceSymbolName: SHTC3
U11 = W25Q80DVSSIG: BOM_Manufacturer: WINBOND; BOM_Supplier: LCSC; BOM_Manufacturer Part: W25Q80DVSSIG; BOM_Supplier Part: C14086; BOM_JLCPCB Part Class: Extended Part; spicePre: U; spiceSymbolName: W25Q80DVSSIG
U12 = LTR-390UV-01: BOM_Manufacturer: Lite-On; Contributor: LCSC; BOM_Supplier: LCSC; BOM_Supplier Part: C492374; BOM_Manufacturer Part: LTR-390UV-01; BOM_JLCPCB Part Class: Extended Part; spicePre: U; spiceSymbolName: LTR-390UV-01
U19 = STM32F103CBT6: BOM_Manufacturer: STMicroelectronics; SMT Type: Basic; timeStamp: 1458840421; BOM_Supplier: LCSC; BOM_Manufacturer Part: STM32F103CBT6; BOM_LCSC Assembly: Yes; image: //image.lceda.cn/szlcsc/C8304.jpg; BOM_Supplier Part: C8304; spicePre: U; BOM_JLCPCB Part Class: Extended Part; spiceSymbolName: STM32F103CBT6
USB1 USB2 = GT-USB-7010B: BOM_Manufacturer: G-Switch(品赞); Contributor: LCSC; BOM_Supplier: LCSC; BOM_Supplier Part: C2837092; BOM_Manufacturer Part: GT-USB-7010B; BOM_JLCPCB Part Class: Extended Part; spicePre: U; spiceSymbolName: GT-USB-7010B
X1 = 32.768KHz: BOM_Manufacturer Part: Q13FC1350000400; BOM_Manufacturer: EPSON; nameAlias: Frequency; BOM_Supplier: LCSC; BOM_Supplier Part: C32346; BOM_JLCPCB Part Class: Basic Part; spicePre: X; spiceSymbolName: Q13FC1350000400
X3 = 8MHz: BOM_Manufacturer: TAITIEN Elec; BOM_Manufacturer Part: XXDCELNANF-8MHZ; nameAlias: Frequency; Contributor: LCSC; BOM_Paste Type: recommend; BOM_Supplier: LCSC; BOM_Supplier Part: C367183; spicePre: X; spiceSymbolName: XXDCELNANF-8MHZ
X5 = 16MHz: BOM_Manufacturer: YXC; BOM_Manufacturer Part: X322516MLB4SI; nameAlias: Frequency; BOM_Supplier: LCSC; BOM_Supplier Part: C13738; BOM_JLCPCB Part Class: Basic Part; spicePre: X; spiceSymbolName: X322516MLB4SI